# EAGLE schematic Sensore esterno (EAGLE 7.7.0)
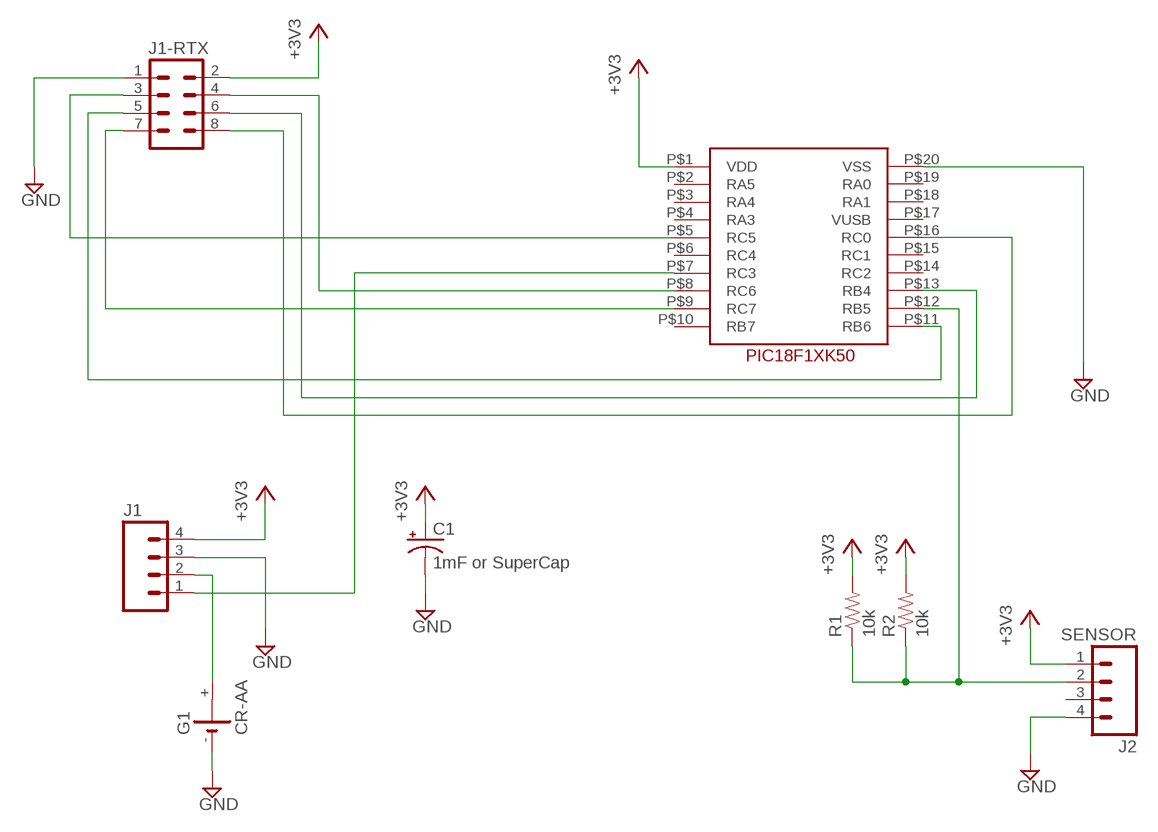
[diagram p0: schematic, sheet 1]

## Parts
C1  1mF or SuperCap  CAP_POLPTH4  [CPOL-RADIAL-1000UF-25V]
G1  CR-AA  [CRAA]
J1  M04NO_SILK_ALL_ROUND  [1X04_NO_SILK_ALL_ROUND]
J1-RTX  M04X2  [2X4]
J2  SENSOR  M04NO_SILK_ALL_ROUND  [1X04_NO_SILK_ALL_ROUND]
R1  10k  RESISTOREZ  [AXIAL-0.3EZ]
R2  10k  RESISTOREZ  [AXIAL-0.3EZ]
U$1  PIC18F1XK50  [SPDIP-20PIN]

## Nets
+3V3: C1.1(+) J1-RTX.2 J1.4 J2.1 R1.P$2 R2.P$2 U$1.P$1(VDD)
GND: C1.2(-) G1.- J1-RTX.1 J1.3 J2.4 U$1.P$20(VSS)
N$1: J1-RTX.3 U$1.P$5(RC5)
N$2: J1-RTX.4 U$1.P$8(RC6)
N$3: J1-RTX.5 U$1.P$11(RB6)
N$4: J1-RTX.6 U$1.P$13(RB4)
N$5: J1-RTX.7 U$1.P$9(RC7)
N$6: J1-RTX.8 U$1.P$16(RC0)
N$7: J1.1 U$1.P$7(RC3)
N$8: G1.+ J1.2
N$9: J2.2 R1.P$1 R2.P$1 U$1.P$12(RB5)
Unconnected: G1.+@1(+) J2.3 U$1.P$2(RA5) U$1.P$3(RA4) U$1.P$4(RA3) U$1.P$6(RC4) U$1.P$10(RB7) U$1.P$14(RC2) U$1.P$15(RC1) U$1.P$17(VUSB) U$1.P$18(RA1) U$1.P$19(RA0)

## Library data of the parts
C1 = SparkFun-Passives:CAP_POL: Capacitor Polarized These are standard SMD and PTH capacitors. Normally 10uF, 47uF, and 100uF in electrolytic and tantalum varieties. Always verify the external diameter of the through hole cap, it varies with capacity, voltage, and manufacturer. The EIA devices should be standard.
G1 = battery:CR-AA: LI BATTERY Varta CRAA-SLF
J1 J2 = SparkFun-Connectors:M04: Header 4 Standard 4-pin 0.1" header. Use with straight break away headers (SKU : PRT-00116), right angle break away headers (PRT-00553), swiss pins (PRT-00743), machine pins (PRT-00117), and female headers (PRT-00115). Molex polarized connector foot print use with SKU : PRT-08231 with associated crimp pins and housings. 1MM SMD Version SKU: PRT-10208; PROD_ID: CONN-09696
J1-RTX = SparkFun-Connectors:M04X2: .1" header, two rows of four.
R1 R2 = SparkFun-Passives:RESISTOR: Resistor Basic schematic elements and footprints for 0603, 1206, and PTH resistors.
U$1 = Luca:PIC18F1XK50